# EAGLE design L&R Overcurrent Analog (EAGLE 6.4)
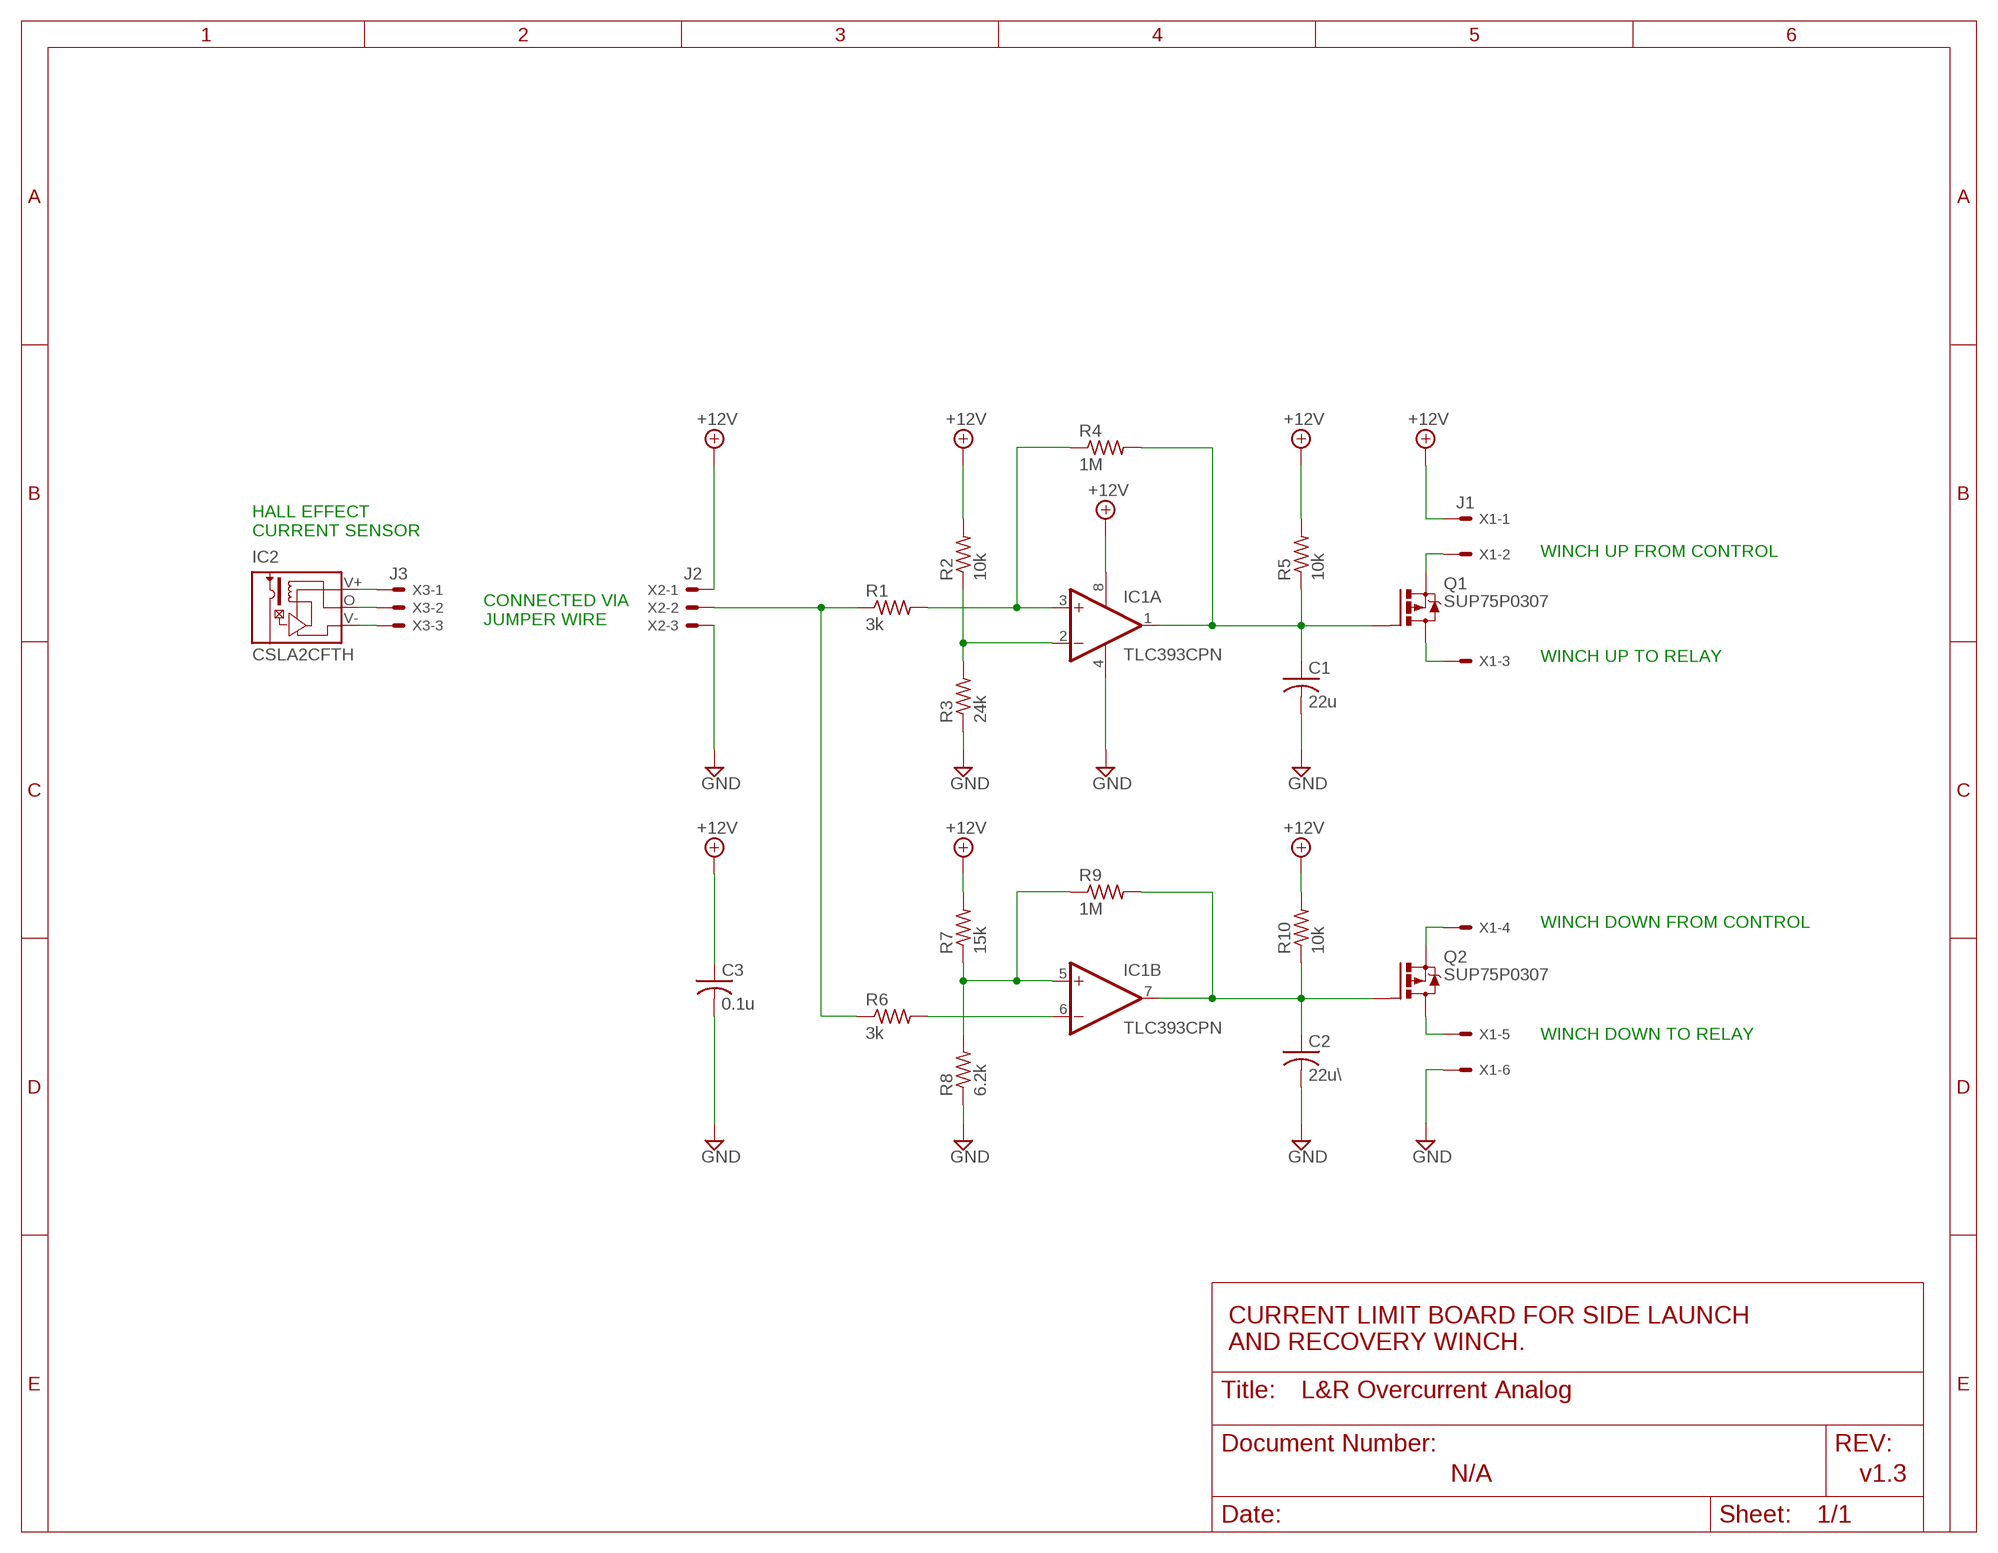
[diagram p0: schematic, sheet 1]

## Parts
C1  22u  CAPACITOR-US025-050X050  [C025-050X050]
C2  22u\  CAPACITOR-US025-050X050  [C025-050X050]
C3  0.1u  CAPACITOR-US  [C050-024X044]
FRAME1  FRAME_A_L  [FRAME_A_L]
IC1  TLC393CPN  [DIL08]
IC2  CSLA2CFTH  [CSLA2CF]
Q1  SUP75P0307  [TO220BV]
Q2  SUP75P0307  [TO220BV]
R1  3k  RESISTOR-US0204/7  [0204/7]
R2  10k  RESISTOR-US0204/7  [0204/7]
R3  24k  RESISTOR-US0204/7  [0204/7]
R4  1M  RESISTOR-US0204/7  [0204/7]
R5  10k  RESISTOR-US0204/7  [0204/7]
R6  3k  RESISTOR-US0204/7  [0204/7]
R7  15k  RESISTOR-US0204/7  [0204/7]
R8  6.2k  RESISTOR-US0204/7  [0204/7]
R9  1M  RESISTOR-US0204/7  [0204/7]
R10  10k  RESISTOR-US0204/7  [0204/7]
U$1  DOCFIELD  [DOCFIELD]
X1  J1  6PIN_HEADER  [22-23-2061]
X2  J2  22-23-2031  [22-23-2031]
X3  J3  22-23-2031  [22-23-2031]

## Nets
+12V: C3.1 IC1.8(P:V+) R2.2 R5.2 R7.2 R10.2 X1.1 X2.1
GND: C1.2 C2.2 C3.2 IC1.4(P:V-) R3.1 R8.1 X1.6 X2.3
N$1: IC1.3(A:+IN) R1.2 R4.1
N$2: IC1.2(A:-IN) R2.1 R3.2
N$4: IC1.6(B:-IN) R6.2
N$5: IC1.5(B:+IN) R7.1 R8.2 R9.1
N$6: C1.1 IC1.1(A:OUT) Q1.G R4.2 R5.1
N$7: C2.1 IC1.7(B:OUT) Q2.G R9.2 R10.1
N$8: Q1.S X1.2
N$9: Q1.D X1.3
N$10: Q2.S X1.4
N$11: Q2.D X1.5
N$12: IC2.V+ X3.1
N$13: IC2.V- X3.3
N$14: IC2.O(M) X3.2
N$15: R1.1 R6.1 X2.2

## Notes on the sheet
- HALL EFFECT
  CURRENT SENSOR
- WINCH UP FROM CONTROL
- CONNECTED VIA
  JUMPER WIRE
- WINCH UP TO RELAY
- WINCH DOWN FROM CONTROL
- WINCH DOWN TO RELAY
- CURRENT LIMIT BOARD FOR SIDE LAUNCH
  AND RECOVERY WINCH.
- N/A | v1.3

## Library data of the parts
C1-C3 = Overcurrent Detect:CAPACITOR-US: CAPACITOR, American symbol
FRAME1 = L&R Overcurrent Analog:FRAME_A_L: FRAME A Size , 8 1/2 x 11 INCH, Landscape
IC1 = Overcurrent Detect:TLC393CP: COMPARATOR
IC2 = Overcurrent Detect:CSLA2CF: Current Transducer CSLA2CF For the electronic measurement of currents: DC, AC Source: Data sheet <http://sensing.honeywell.com/product%20page?pr_id=4790>
Q1 Q2 = Overcurrent Detect:SUP75P03: P-Channel Power MOSFET
R1-R10 = Overcurrent Detect:RESISTOR-US: RESISTOR, American symbol
U$1 = L&R Overcurrent Analog:DOCFIELD
X1 = Overcurrent Detect:6PIN_HEADER: .100" (2.54mm) Center Header - 6 Pin; MF: MOLEX; MPN: 22-23-2061; OC_FARNELL: 1462922; OC_NEWARK: 27C1933
X2 X3 = Overcurrent Detect:22-23-2031: .100" (2.54mm) Center Header - 3 Pin; MF: MOLEX; MPN: 22-23-2031; OC_FARNELL: 1462950; OC_NEWARK: 30C0862

## Board
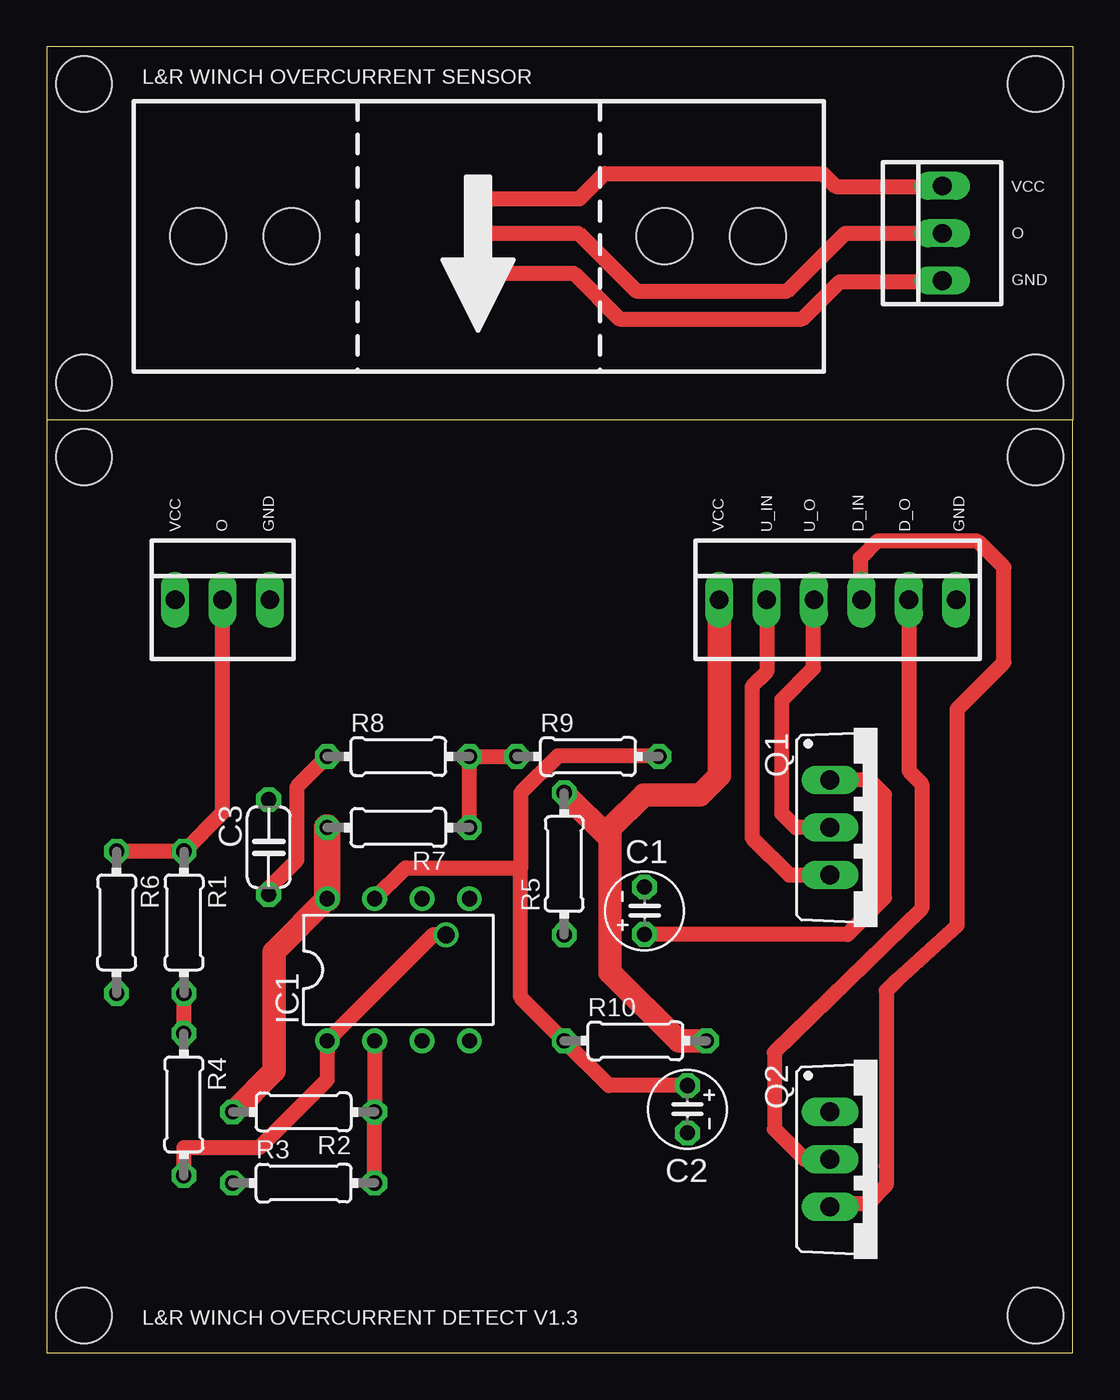
[diagram p1: board, top side]
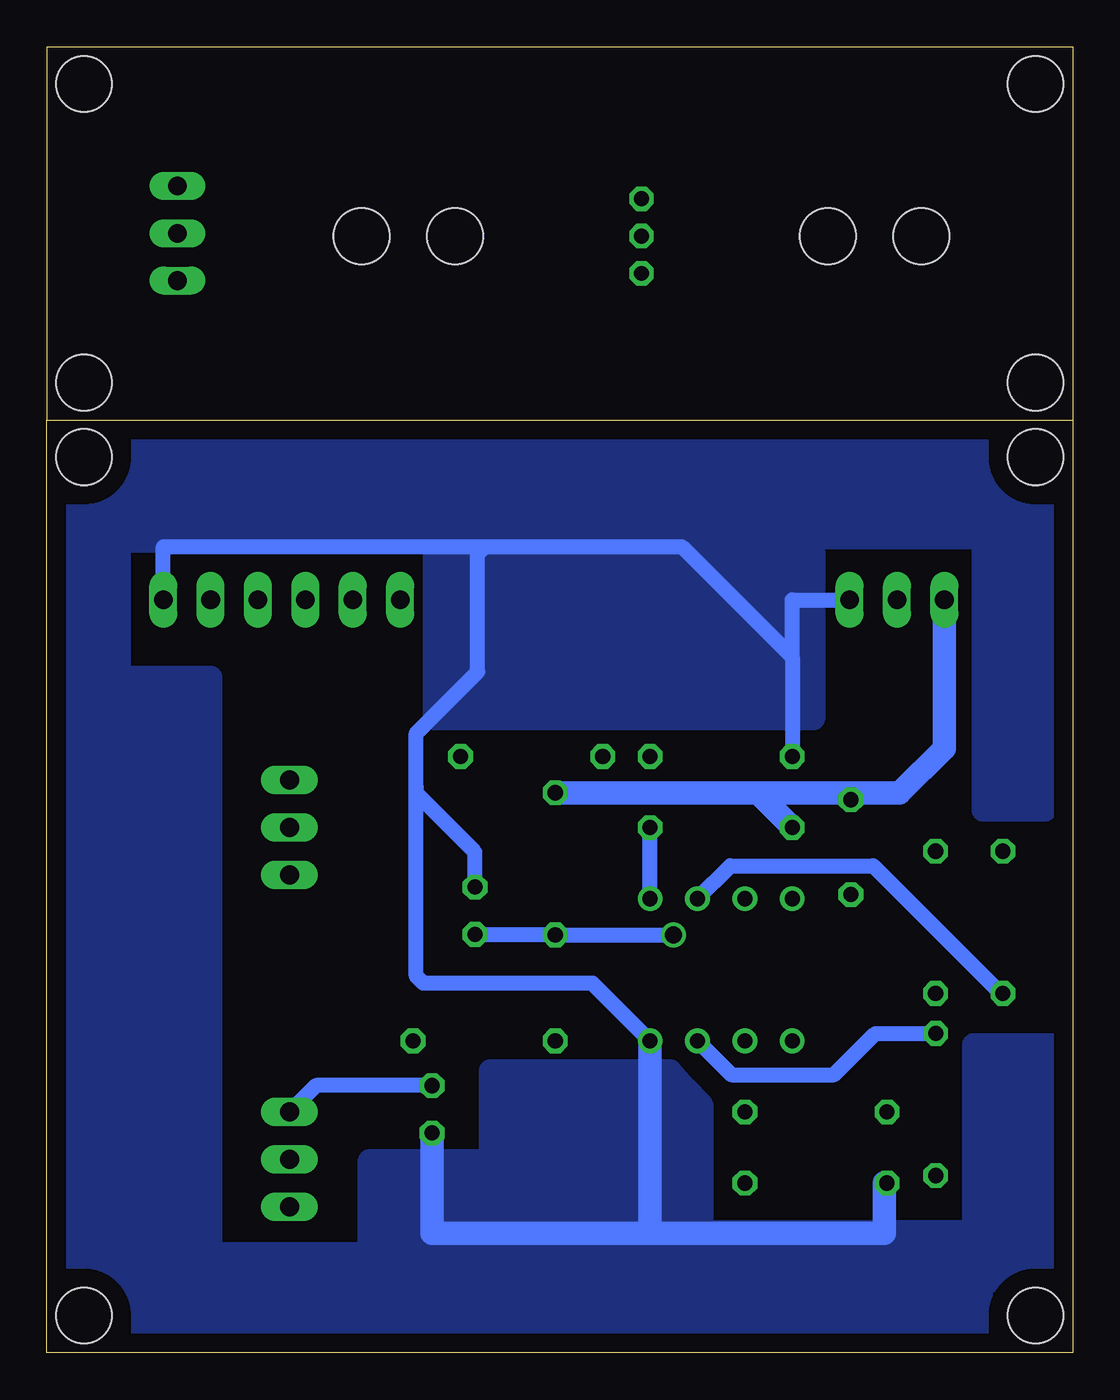
[diagram p2: board, bottom side, seen from below]

Size 55 x 70 mm. Coordinates in mm from the lower left corner, seen from the top.
Outline: 55,50 55,0 0,0 0,50
Outline: 55,50 55,70 0,70 0,50
Outline: 55,50 0,50
Copper layers (1*16): Top 0.035mm / dielectric 1.5mm / Bottom 0.035mm
Design rules "default *": minimum track width 10mil, minimum drill 24mil, track to track 10mil, track to pad 10mil, pad to pad 10mil, via to via 10mil, smd to smd 10mil, copper to edge 40mil, drill to drill 8mil, minimum pad ring 10mil, minimum via ring 8mil, stop-mask expansion 4mil, vias tented up to drill 0mil, thermal gap 10mil
Holes 3 mm at 53,2 2,2 2,48 53,48 2,52 2,68 53,68 53,52

### Footprints (pad centres in the part's own frame; a part is rotated, then mirrored left to right if it is on the bottom)
C025-050X050 = drill 0.813 octagon: 1 -1.27,0; 2 1.27,0
C050-024X044 = drill 0.813 octagon: 1 -2.54,0; 2 2.54,0
DIL08 = drill 0.813 pad 1.27: 1 -3.81,-3.81; 2 -1.27,-3.81; 3 1.27,-3.81; 4 3.81,-3.81; 5 3.81,3.81; 6 1.27,3.81; 7 -1.27,3.81; 8 -3.81,3.81
CSLA2CF = drill 0.8 octagon: O 0,0; V+ 0,-2; V- 0,2 | hole 3: -10,0; 10,0; 15,0; -15,0
TO220BV = drill 1.016 long: D 0,-2.54; G -2.54,-2.54; S 2.54,-2.54
0204/7 = drill 0.813 octagon: 1 -3.81,0; 2 3.81,0
22-23-2061 = drill 1 long: 1 -6.35,0; 2 -3.81,0; 3 -1.27,0; 4 1.27,0; 5 3.81,0; 6 6.35,0
22-23-2031 = drill 1 long: 1 -2.54,0; 2 0,0; 3 2.54,0

### Placement (x,y rotation side)
C1  32.04,23.69 90 top
C2  34.34,13.05 270 top
C3  11.9,27.1 270 top
FRAME1  -112.51,-79.09 0 top  (outside the outline)
IC1  18.85,20.53 0 top
IC2  23.12,59.85 0 top
Q1  44.52,28.15 270 top
Q2  44.52,10.37 270 top
R1  7.36,23.07 270 top
R2  13.77,12.91 180 top
R3  13.77,9.1 0 top
R4  7.35,13.31 270 top
R5  27.74,26.21 90 top
R6  3.75,23.07 270 top
R7  18.85,28.15 180 top
R8  18.85,31.96 0 top
R9  29.01,31.96 0 top
R10  31.55,16.72 0 top
U$1  59.46,-79.01 0 top  (outside the outline)
X1  42.4,40.36 0 top
X2  9.43,40.35 0 top
X3  48,60 90 top

### Tracks (layer width: path | path; a pad name or v marks a point on that pad's centre or on a via)
+12V
  Top 1.27: R10.2 33.88,16.72 30.2,20.4 30.2,27.56 | IC1.8 12.2,21.5 12.2,15.1 10.01,12.91 R2.2 | R5.2 30.2,27.56 | X1.1 36.05,30.95 35,29.9 32,29.9 30.2,28.1 30.2,27.56
  Top 1.422: R7.2 IC1.8
  Bottom 1.27: R5.2 25.89,30 16.89,30 | 16.89,30 R7.2 | C3.1 12.26,30 | 12.26,30 16.89,30 | 12.26,30 9.3,30 6.9,32.4 6.9,40.34 X2.1
GND
  Top 0.813: R8.1 13.4,30.32 13.4,26.4 11.9,24.9 C3.2
  Bottom 0.813: 15.04,37.28 R8.1 | X1.6 48.75,43.2 31.5,43.2 | 12,40.35 X2.3 15.04,40.35 15.04,37.28 | C1.2 32.04,26.84 35.2,30 | 35.2,30 35.2,30.3 35.2,33.2 31.9,36.5 31.9,42.8 31.5,43.2 | IC1.4 25.74,19.8 34.8,19.8 35.2,20.2 35.2,30 | 31.5,43.2 20.96,43.2 15.04,37.28
  Bottom 1.27: IC1.4 22.66,6.4 | 22.66,6.4 10.1,6.4 10.1,9.1 R3.1 | 22.66,6.4 34.34,6.4 C2.2
  pour Bottom (isolate 0.305): 51.4,48.5 3.5,48.5 3.5,47 1.5,47 1.5,29.1 4.8,29.1 4.8,43.7 13.9,43.7 13.9,34 34.2,34 34.2,43.5 51.1,43.5 51.1,36.2 46.2,36.2 46.2,5.3 37.7,5.3 37.7,10.3 31.2,10.3 31.2,15.1 21.6,15.1 20.8,14.2 19.9,13.3 19.9,6.5 5.3,6.5 5.3,16.5 1.1,16.5 1.1,3.9 4.9,3.9 4.9,1.5 51.4,1.5 51.4,1.9 51.1,1.9 51.1,4.7 53.4,4.7 53.4,45.9 51.4,45.9
N$1
  Top 0.813: R1.2 R4.1
  Bottom 0.813: IC1.3 18.3,14.9 12.8,14.9 10.58,17.12 R4.1
N$2
  Top 0.813: R3.2 R2.1 IC1.2
N$4
  Bottom 0.813: IC1.6 18.36,26.1 10.7,26.1 3.86,19.26 R6.2
N$5
  Top 0.813: R7.1 R8.2 R9.1
  Bottom 0.813: IC1.5 R7.1
N$6  (via drill 0.9)
  Top 0.813: Q1.G 44.1,30.7 44.9,29.9 44.9,24.4 42.92,22.42 C1.1 | R4.2 7.35,11 11.4,11 15.04,14.64 IC1.1 20.72,22.4 v21.4,22.4
  Bottom 0.813: C1.1 32.02,22.4 R5.1 v21.4,22.4
N$7
  Top 0.813: R9.2 32.78,32 27.4,32 25.4,30 25.4,26 | 27.68,16.72 R10.1 | IC1.7 19.24,26 25.4,26 | R10.1 25.4,19.06 25.4,26 | C2.1 30.14,14.32 R10.1
  Bottom 0.813: C2.1 40.57,14.32 Q2.G
N$8
  Top 0.813: Q1.S 39.8,25.6 37.8,27.6 37.8,35.7 38.59,36.49 X1.2
N$9
  Top 0.813: Q1.D 40.15,28.15 39.4,28.9 39.4,35 41.1,36.7 41.1,40.33 X1.3
N$10
  Top 0.813: X1.4 43.6,40.43 43.6,42.6 44.5,43.5 49.9,43.5 51.3,42.1 51.3,37 48.8,34.5 48.8,22.9 45.6,20 45,19.4 45,10 45,9 44,8 42.15,8 Q2.S
N$11
  Top 0.813: X1.5 46.21,31.19 46.9,30.5 46.9,23.8 39,16.1 39,12 40.63,10.37 Q2.D
N$12
  Top 0.813: IC2.V+ 28.25,57.85 30.7,55.4 40.5,55.4 42.5,57.4 47.94,57.4 X3.1
N$13
  Top 0.813: IC2.V- 28.55,61.85 29.9,63.2 41.6,63.2 42.3,62.5 47.96,62.5 X3.3
N$14
  Top 0.813: IC2.O 23.27,60 28.5,60 31.6,56.9 39.7,56.9 42.8,60 X3.2
N$15
  Top 0.813: R6.1 R1.1 9.43,28.95 X2.2

### Text on the board
tPlace: L&R WINCH OVERCURRENT SENSOR | VCC | O | GND | VCC | O | GND | VCC | U_IN | U_O | D_IN | D_O | GND | L&R WINCH OVERCURRENT DETECT V1.3
Document: CURRENT LIMIT BOARD FOR SIDE LAUNCH / AND RECOVERY WINCH. | N/A | v1.3 | 1/1